# EAGLE design modul_zegara (EAGLE 9.7.0)
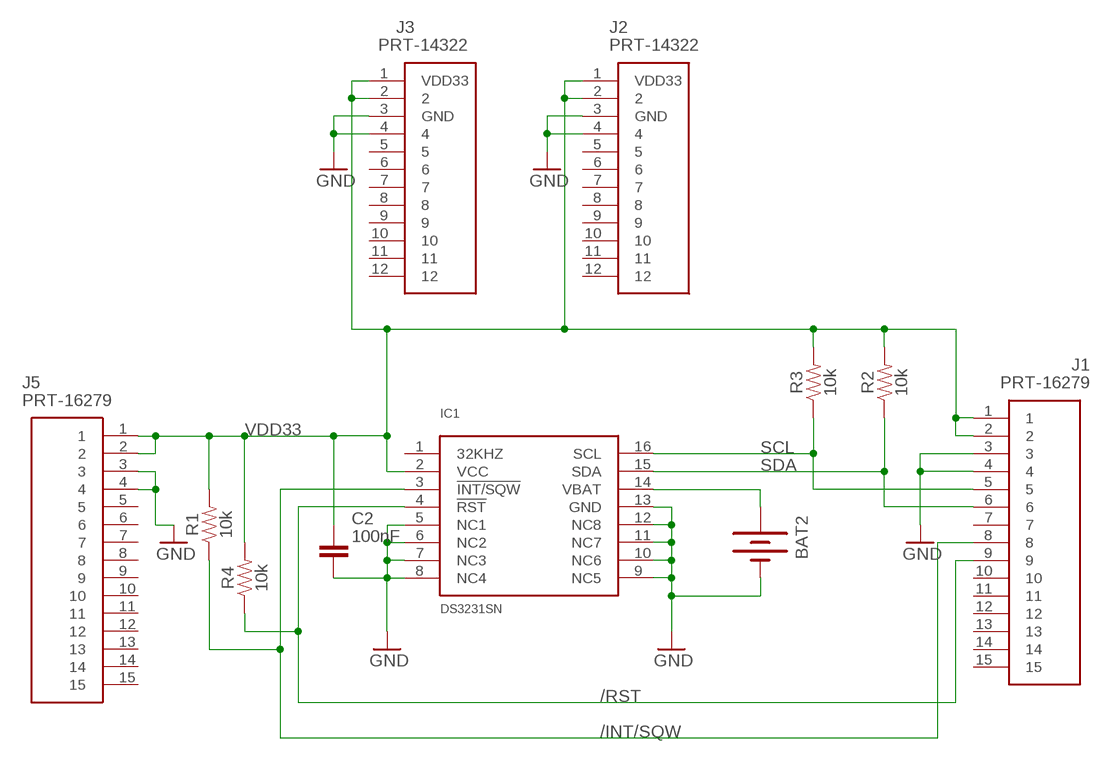
[diagram p0: schematic, sheet 1]

## Parts
BAT2  BATTERY20PTH  [BATTCOM_20MM_PTH]
C2  100nF  C_CHIP-1206(3216-METRIC)  [CAPC3216X135]
IC1  DS3231SN  [SO16W]
J1  PRT-16279  [PRT16279]
J2  PRT-14322  [RHDR12W87P0X254_1X12_3103X250X]
J3  PRT-14322  [RHDR12W87P0X254_1X12_3103X250X]
J5  PRT-16279  [PRT16279]
R1  10k  10KOHM-HORIZ-1/4W-1%  [AXIAL-0.3]
R2  10k  10KOHM-HORIZ-1/4W-1%  [AXIAL-0.3]
R3  10k  10KOHM-HORIZ-1/4W-1%  [AXIAL-0.3]
R4  10k  10KOHM-HORIZ-1/4W-1%  [AXIAL-0.3]

## Nets
/INT/SQW: IC1.3(!INT/SQW) J1.8 R1.P$1
/RST: IC1.4(!RST) J1.9 R4.P$1
GND: BAT2.2(-) C2.2 IC1.5(NC1) IC1.6(NC2) IC1.7(NC3) IC1.8(NC4) IC1.9(NC5) IC1.10(NC6) IC1.11(NC7) IC1.12(NC8) IC1.13(GND) J1.3 J1.4 J2.3(GND) J2.4 J3.3(GND) J3.4 J5.3 J5.4
N$3: BAT2.1(+) IC1.14(VBAT)
SCL: IC1.16(SCL) J1.5 R3.P$1
SDA: IC1.15(SDA) J1.6 R2.P$1
VDD33: C2.1 IC1.2(VCC) J1.1 J1.2 J2.1(VDD33) J2.2 J3.1(VDD33) J3.2 J5.1 J5.2 R1.P$2 R2.P$2 R3.P$2 R4.P$2
Unconnected: IC1.1(32KHZ) J1.7 J1.10 J1.11 J1.12 J1.13 J1.14 J1.15 J2.5 J2.6 J2.7 J2.8 J2.9 J2.10 J2.11 J2.12 J3.5 J3.6 J3.7 J3.8 J3.9 J3.10 J3.11 J3.12 J5.5 J5.6 J5.7 J5.8 J5.9 J5.10 J5.11 J5.12 J5.13 J5.14 J5.15

## Library data of the parts
BAT2 = SparkFun:BATTERY: Battery Holders Various common sizes : AA, AAA, 20mm coin cell and 12mm coin cell.
C2 = Tutorial - Fusion 360:C: Capacitor - Generic; CATEGORY: Capacitor
IC1 = comfile:DS3231SN
J1 J5 = PRT-16279:PRT-16279: ARDUINO NANO STACKABLE HEADERS Source: Datasheet <https://cdn.sparkfun.com/assets/8/d/8/4/7/DS-16279-Arduino_Nano_Stackable_Header_Kit.pdf>; DESCRIPTION: ARDUINO NANO STACKABLE HEADERS; HEIGHT: 8.65mm; MANUFACTURER_NAME: SparkFun; MANUFACTURER_PART_NUMBER: PRT-16279; MOUSER_PART_NUMBER: 474-PRT-16279; MOUSER_PRICE-STOCK: https://www.mouser.co.uk/ProductDetail/SparkFun/PRT-16279?qs=vmHwEFxEFR8I6W1vfufYPg%3D%3D
J2 J3 = PRT-14322:PRT-14322: SparkFun Accessories Photon Stackable Header- 12 Pin Source: Datasheet <https://cdn.sparkfun.com/datasheets/Prototyping/SP-140520-XX-001.pdf>; DESCRIPTION: SparkFun Accessories Photon Stackable Header- 12 Pin; HEIGHT: 8.65mm; MANUFACTURER_NAME: SparkFun; MANUFACTURER_PART_NUMBER: PRT-14322; MOUSER_PART_NUMBER: 474-PRT-14322; MOUSER_PRICE-STOCK: https://www.mouser.co.uk/ProductDetail/SparkFun/PRT-14322?qs=YCa%2FAAYMW006l9RrtPHkxQ%3D%3D
R1-R4 = SparkFun-Resistors:10KOHM: 10kΩ resistor A resistor is a passive two-terminal electrical component that implements electrical resistance as a circuit element. Resistors act to reduce current flow, and, at the same time, act to lower voltage levels within circuits. - Wikipedia; PROD_ID: RES-12183

## Board
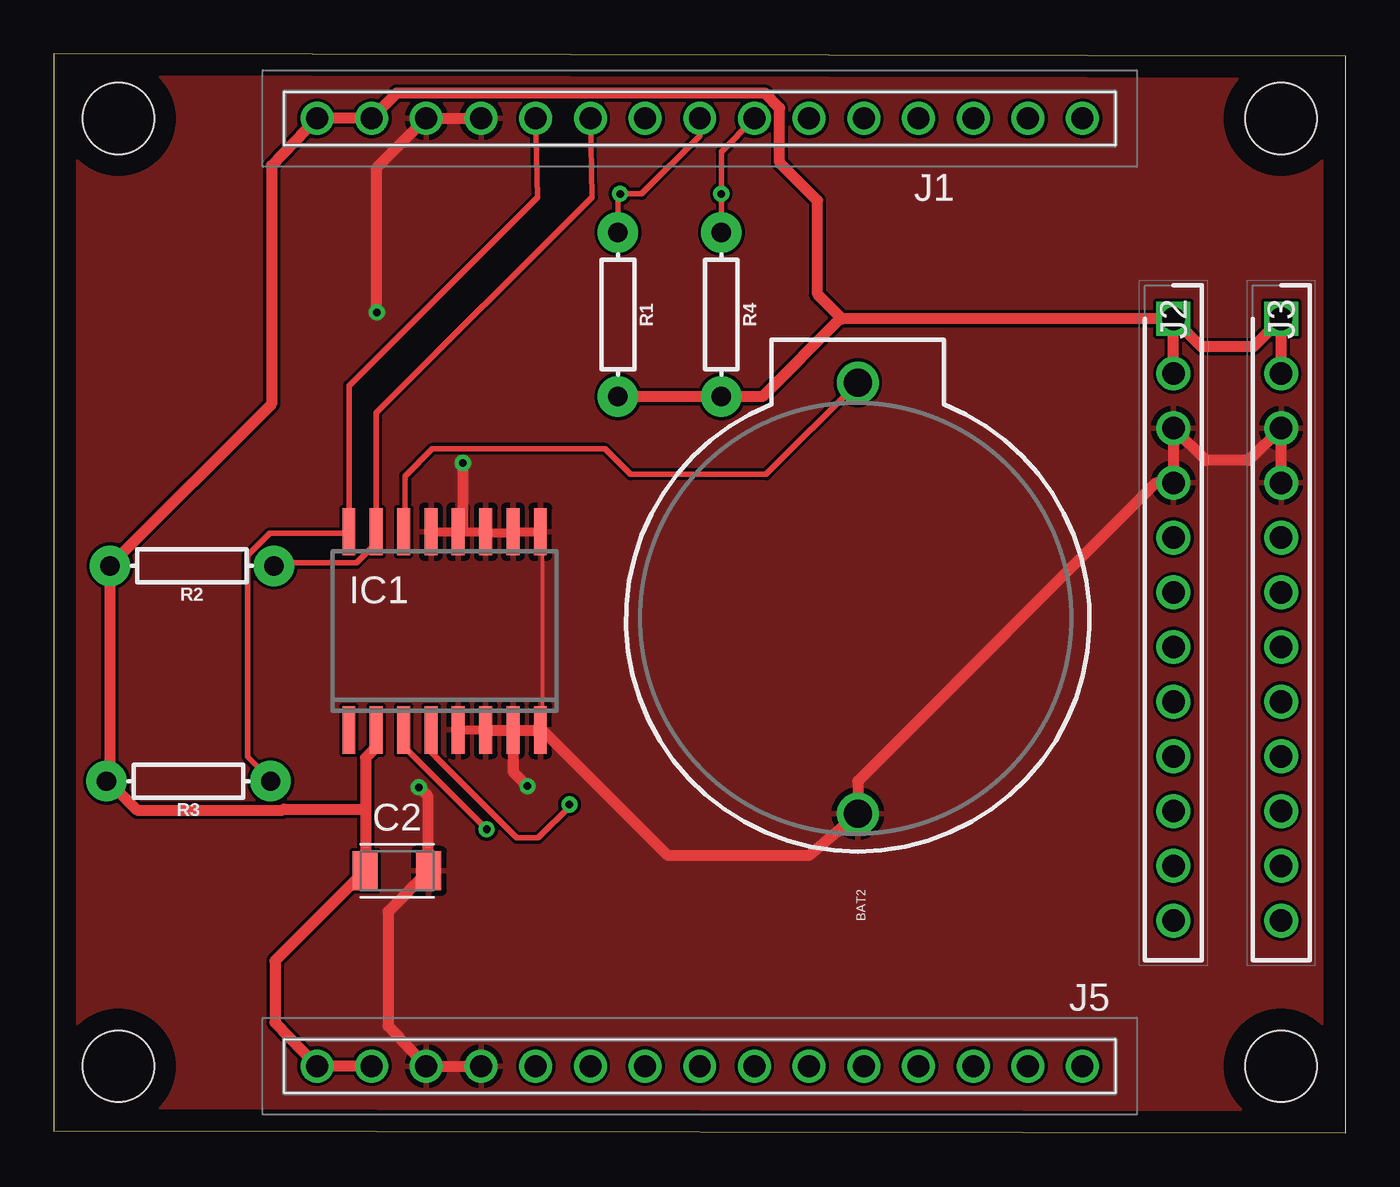
[diagram p1: board, top side]
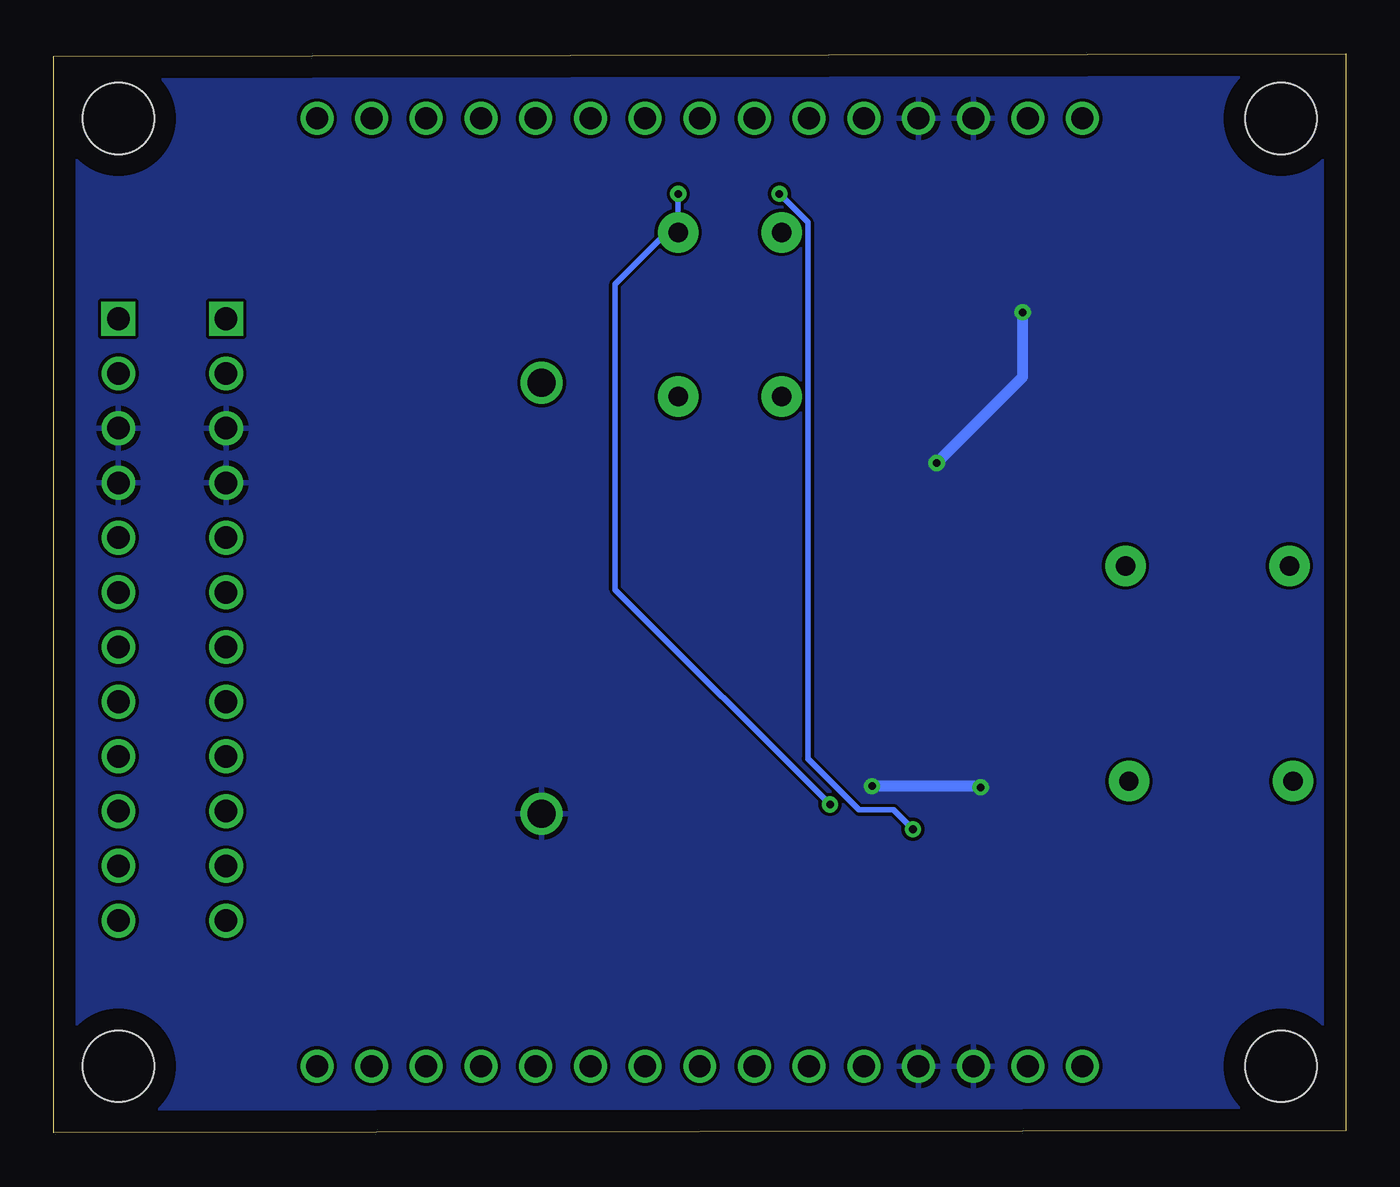
[diagram p2: board, bottom side, seen from below]

Size 60 x 50.1 mm. Coordinates in mm from the lower left corner, seen from the top.
Outline: 0,0.1 60,0 60,50 0,50.1 0,0.1
Copper layers (1*16): Top 0.035mm / dielectric 1.5mm / Bottom 0.035mm
Design rules "Fusion Electronics Design Rules": minimum track width 6mil, minimum drill 0.35mm, track to track 6mil, track to pad 6mil, pad to pad 6mil, via to via 6mil, smd to smd 6mil, copper to edge 40mil, drill to drill 6mil, minimum pad ring 10mil, minimum via ring 8mil, stop-mask expansion 4mil, vias tented up to drill 9999mil, thermal gap 10mil

### Footprints (pad centres in the part's own frame; a part is rotated, then mirrored left to right if it is on the bottom)
BATTCOM_20MM_PTH = drill 1.3: 1 20,0; 2 0,0
CAPC3216X135 = smd 1.165 x 1.815: 1 -1.475,0; 2 1.475,0
SO16W = smd 0.6 x 2.2: 1 -4.445,-4.6; 2 -3.175,-4.6; 3 -1.905,-4.6; 4 -0.635,-4.6; 5 0.635,-4.6; 6 1.905,-4.6; 7 3.175,-4.6; 8 4.445,-4.6; 9 4.445,4.6; 10 3.175,4.6; 11 1.905,4.6; 12 0.635,4.6; 13 -0.635,4.6; 14 -1.905,4.6; 15 -3.175,4.6; 16 -4.445,4.6
PRT16279 = drill 1.02 pad 1.53: 1 -17.78,0; 2 -15.24,0; 3 -12.7,0; 4 -10.16,0; 5 -7.62,0; 6 -5.08,0; 7 -2.54,0; 8 0,0; 9 2.54,0; 10 5.08,0; 11 7.62,0; 12 10.16,0; 13 12.7,0; 14 15.24,0; 15 17.78,0
RHDR12W87P0X254_1X12_3103X250X = drill 1.05 pad 1.575 square: 1 -12.7,0 | drill 1.05 pad 1.575: 2 -10.16,0; 3 -7.62,0; 4 -5.08,0; 5 -2.54,0; 6 0,0; 7 2.54,0; 8 5.08,0; 9 7.62,0; 10 10.16,0; 11 12.7,0; 12 15.24,0
AXIAL-0.3 = drill 0.9 pad 1.88: P$1 -3.81,0; P$2 3.81,0
STAND-OFF = hole 3.302: 0,0

### Placement (x,y rotation side)
BAT2  37.34,14.83 90 top
C2  15.94,12.17 0 top
IC1  18.15,23.31 0 top
J1  30,47.1 0 top
J2  52,25.1 270 top
J3  57,25.1 270 top
J5  30,3.1 0 top
R1  26.2,38 270 top
R2  6.42,26.33 180 top
R3  6.26,16.33 180 top
R4  31,38 270 top
STANDOFF1  STAND-OFF  [STAND-OFF]  57,3.1 0 top
STANDOFF2  STAND-OFF  [STAND-OFF]  3,3.1 0 top
STANDOFF3  STAND-OFF  [STAND-OFF]  3,47.1 0 top
STANDOFF4  STAND-OFF  [STAND-OFF]  57,47.1 0 top

### Tracks (layer width: path | path; a pad name or v marks a point on that pad's centre or on a via)
/INT/SQW  (via drill 0.35)
  Top 0.254: IC1.3 16.25,17.96 v20.1,14.1 | J1.8 30,46.35 30.01,46.31 27.3,43.6 v26.3,43.6 26.2,43.5 R1.P$1
  Bottom 0.254: v20.1,14.1 21,15 22.6,15 24.98,17.38 24.98,42.28 v26.3,43.6
/RST  (via drill 0.35)
  Top 0.254: IC1.4 17.52,17.69 21.5,13.7 22.5,13.7 24,15.2 v23.95,15.25 | J1.9 31,45.56 v31,43.6 R4.P$1
  Bottom 0.254: v31,43.6 31,42.33 33.93,39.41 33.93,25.23 v23.95,15.25
GND  (via drill 0.35)
  Top 0.152: IC1.9 22.71,27.84 22.71,18.85 IC1.8 22.71,18.69
  Top 0.254: IC1.12 18.75,27.84 19,28.09
  Top 0.406: IC1.5 IC1.6 | IC1.9 IC1.10 21.18,27.84 20.13,27.84 IC1.11 IC1.12 IC1.13
  Top 0.508: 21.34,18.69 | 22.71,18.69 28.5,12.9 35.1,12.9 BAT2.2 37.34,16.33 51.19,30.18 J2.4 J2.3 53.5,31.22 55.5,31.22 J3.3 J3.4 | v15,38.1 15,44.8 J1.3 J1.4 | v19,31.1 19,28.09 IC1.12 | v22,16.1 21.34,16.76 21.34,18.69 | J5.4 J5.3 15.52,4.96 15.52,10.27 C2.2 17.37,12.29 17.37,15.62 v16.95,16.05 | IC1.6 20.12,18.69 21.34,18.69 | 21.34,18.69 22.55,18.69 IC1.8 | 21.34,18.69 IC1.7
  Bottom 0.508: v19,31.1 15,35.1 v15,38.1 | v22,16.1 17,16.1 v16.95,16.05
  pour Top: 0.08,0.18 59.92,0.18 59.92,50.02 0.08,50.02
  pour Bottom: 0.08,0.18 59.92,0.18 59.92,50.02 0.08,50.02
N$3
  Top 0.152: 16.31,28.45 16.31,27.99 IC1.14
  Top 0.254: 16.31,28.45 16.31,30.5 17.57,31.76 25.61,31.76 26.8,30.57 33.08,30.57 BAT2.1
SCL
  Top 0.152: R3.P$1 10.06,16.41
  Top 0.254: 10.06,16.41 8.99,17.47 8.99,26.82 10.01,27.84 13.56,27.84 IC1.16 13.71,34.7 22.46,43.45 J1.5
SDA
  Top 0.152: R2.P$1 10.36,26.46 | 14.94,27.38 14.94,27.84 IC1.15 14.94,27.38
  Top 0.254: 14.94,27.35 14.94,27.38 | 10.36,26.46 14.05,26.46 14.94,27.35 | IC1.15 14.97,33.1 14.97,33.43 25,43.45 J1.6 | IC1.15 14.94,27.35 | 14.94,27.35 IC1.15
VDD33
  Top 0.152: 2.59,16.41 R3.P$2 2.59,16.25 | 2.59,26.31 R2.P$2 2.74,26.46
  Top 0.508: 14.48,15.04 14.48,17.41 14.97,17.91 IC1.2 | 14.48,15.04 14.48,12.9 C2.1 10.28,7.98 10.28,5.12 J5.1 J5.2 | 2.59,26.31 2.59,16.41 | 2.74,26.46 10.12,33.84 10.12,44.92 J1.1 J1.2 15.93,48.27 33.02,48.27 33.71,47.59 33.71,45.05 35.47,43.29 35.47,38.95 36.57,37.84 | 14.48,15.04 10.68,15.04 10.63,14.98 3.86,14.98 2.59,16.25 | J2.2 J2.1 | J2.1 53.3,36.5 55.7,36.5 J3.1 J3.2 | J2.1 36.61,37.8 36.57,37.84 | R1.P$2 R4.P$2 32.91,34.19 36.57,37.84